# Altium schematic sheet PIC_TD3.SchDoc: TDIII_Trabajo Práctico 01
size A4; Date: 06/04/2024; Author: L. Campos; DrawnBy: L. Campos; DocumentNumber: 01; Revision: A; SheetNumber: 1; SheetTotal: 1
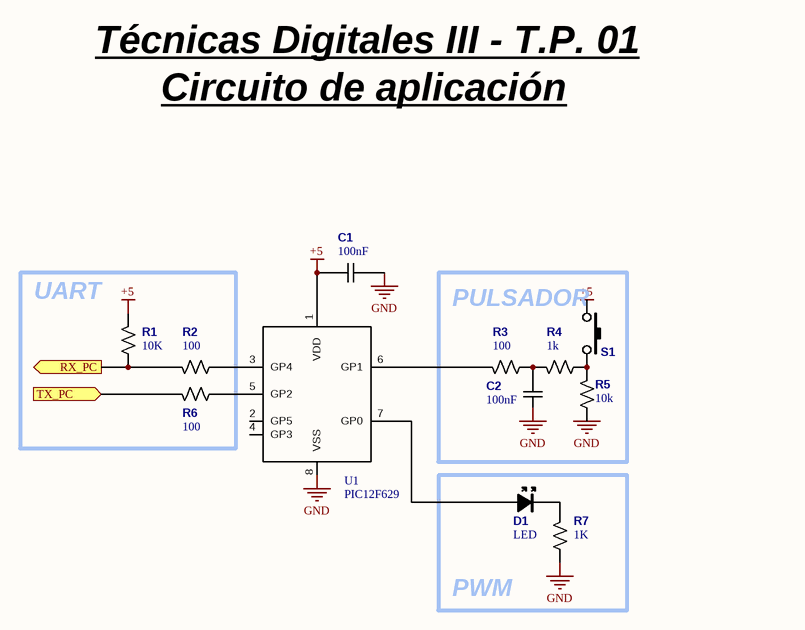
[diagram p0: PIC_TD3.SchDoc]

## Parts
C1  100nF
C2  100nF
D1  LED
R1  10K
R2  100
R3  100
R4  1k
R5  10k
R6  100
R7  1K
S1  PULSADOR  (value not drawn)
U1  PIC12F629

## Blocks framed on the sheet
UART: R1 R2 R6
PULSADOR: C2 R3-R5 S1
PWM: D1 R7

## Ports
RX_PC (out), TX_PC (in)

## Nets
+5: C1.1 R1.2 S1.1 U1.1(VDD)
GND: C1.2 C2.1 R5.1 R7.1 U1.8(VSS)
RX_PC: R1.1 R2.2 ; port RX_PC
TX_PC: R6.2 ; port TX_PC
NetC2_2: C2.2 R3.1 R4.2
NetD1_A: D1.A U1.7(GP0)
NetD1_K: D1.K R7.2
NetR2_1: R2.1 U1.3(GP4)
NetR3_2: R3.2 U1.6(GP1)
NetR4_1: R4.1 R5.2 S1.2
NetR6_1: R6.1 U1.5(GP2)

Not connected (* = marked no-connect by the designer): U1 2(GP5) 4(GP3)

## Notes on the sheet
- Técnicas Digitales III - T.P. 01
- Circuito de aplicación

## Library data of the parts
C1 C2 = CAP: CAPACITOR NO POLARIZADO; CODIGO: *; VERSION: *; DESCRIPCION: *; CLASE: *; ENCAPSULADO: *
R1-R7 = RES: CODIGO: *; VERSION: *; DESCRIPCION: *; CLASE: *; ENCAPSULADO: *
S1 = SW-PULSADOR: SWITCH PULSADOR; CODIGO: *; VERSION: *; DESCRIPCION: *; CLASE: *; ENCAPSULADO: *
D1 = LED: CODIGO: *; VERSION: *; DESCRIPCION: *; CLASE: *; ENCAPSULADO: *